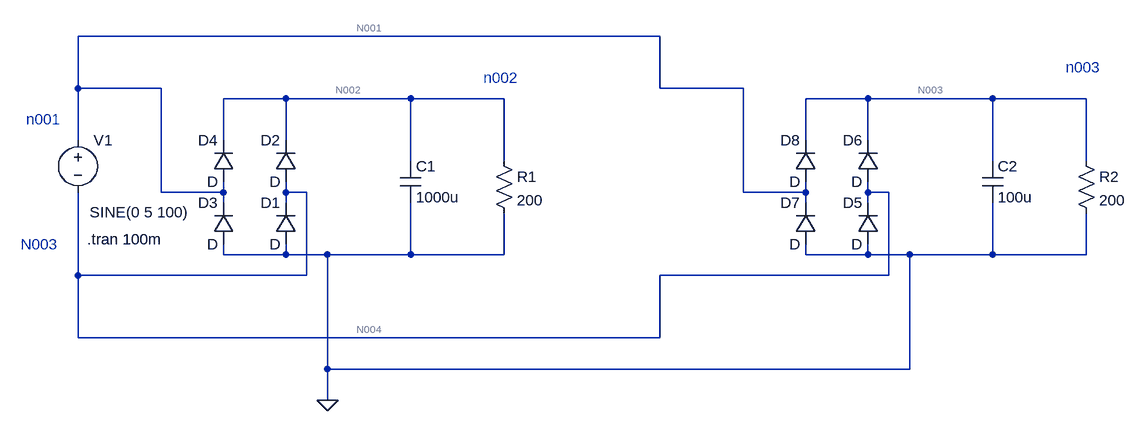
[diagram p0: schematic Yoneda-p88__Full-rectifier__with-2C_1000-100.asc]
Yoneda-p88__Full-rectifier__with-2C_1000-100.asc, the LTspice schematic file:
Version 4
SHEET 1 916 680
WIRE 192 -128 -704 -128
WIRE -704 -48 -704 -128
WIRE -576 -48 -704 -48
WIRE 192 -48 192 -128
WIRE 320 -48 192 -48
WIRE -384 -32 -480 -32
WIRE -192 -32 -384 -32
WIRE -48 -32 -192 -32
WIRE 512 -32 416 -32
WIRE 704 -32 512 -32
WIRE 848 -32 704 -32
WIRE -704 32 -704 -48
WIRE -480 32 -480 -32
WIRE -384 32 -384 -32
WIRE 416 32 416 -32
WIRE 512 32 512 -32
WIRE -192 64 -192 -32
WIRE -48 64 -48 -32
WIRE 704 64 704 -32
WIRE 848 64 848 -32
WIRE -576 112 -576 -48
WIRE -480 112 -480 96
WIRE -480 112 -576 112
WIRE -384 112 -384 96
WIRE -352 112 -384 112
WIRE 320 112 320 -48
WIRE 416 112 416 96
WIRE 416 112 320 112
WIRE 512 112 512 96
WIRE 544 112 512 112
WIRE -480 128 -480 112
WIRE -384 128 -384 112
WIRE 416 128 416 112
WIRE 512 128 512 112
WIRE -480 208 -480 192
WIRE -384 208 -384 192
WIRE -384 208 -480 208
WIRE -320 208 -384 208
WIRE -192 208 -192 128
WIRE -192 208 -320 208
WIRE -48 208 -48 144
WIRE -48 208 -192 208
WIRE 416 208 416 192
WIRE 512 208 512 192
WIRE 512 208 416 208
WIRE 576 208 512 208
WIRE 704 208 704 128
WIRE 704 208 576 208
WIRE 848 208 848 144
WIRE 848 208 704 208
WIRE -704 240 -704 112
WIRE -352 240 -352 112
WIRE -352 240 -704 240
WIRE 544 240 544 112
WIRE 544 240 192 240
WIRE -704 336 -704 240
WIRE 192 336 192 240
WIRE 192 336 -704 336
WIRE -320 384 -320 208
WIRE 576 384 576 208
WIRE 576 384 -320 384
WIRE -320 432 -320 384
FLAG -320 432 0
SYMBOL diode -368 192 R180
WINDOW 0 24 64 Left 2
WINDOW 3 24 0 Left 2
SYMATTR InstName D1
SYMBOL diode -368 96 R180
WINDOW 0 24 64 Left 2
WINDOW 3 24 0 Left 2
SYMATTR InstName D2
SYMBOL diode -464 192 R180
WINDOW 0 24 64 Left 2
WINDOW 3 24 0 Left 2
SYMATTR InstName D3
SYMBOL diode -464 96 R180
WINDOW 0 24 64 Left 2
WINDOW 3 24 0 Left 2
SYMATTR InstName D4
SYMBOL res -64 48 R0
SYMATTR InstName R1
SYMATTR Value 200
SYMBOL voltage -704 16 R0
WINDOW 3 18 127 Left 2
WINDOW 123 0 0 Left 2
WINDOW 39 0 0 Left 2
SYMATTR InstName V1
SYMATTR Value SINE(0 5 100)
SYMBOL cap -208 64 R0
SYMATTR InstName C1
SYMATTR Value 1000u
SYMBOL diode 528 192 R180
WINDOW 0 24 64 Left 2
WINDOW 3 24 0 Left 2
SYMATTR InstName D5
SYMBOL diode 528 96 R180
WINDOW 0 24 64 Left 2
WINDOW 3 24 0 Left 2
SYMATTR InstName D6
SYMBOL diode 432 192 R180
WINDOW 0 24 64 Left 2
WINDOW 3 24 0 Left 2
SYMATTR InstName D7
SYMBOL diode 432 96 R180
WINDOW 0 24 64 Left 2
WINDOW 3 24 0 Left 2
SYMATTR InstName D8
SYMBOL res 832 48 R0
SYMATTR InstName R2
SYMATTR Value 200
SYMBOL cap 688 64 R0
SYMATTR InstName C2
SYMATTR Value 100u
TEXT -690 184 Left 2 !.tran 100m
TEXT -784 0 Left 2 ;n001
TEXT -792 192 Left 2 ;N003
TEXT 816 -80 Left 2 ;n003
TEXT -80 -64 Left 2 ;n002

The netlist it stands for:
* Yoneda-p88__Full-rectifier__with-2C_1000-100.asc
D1 0 N004 D
D2 N004 N002 D
D3 0 N001 D
D4 N001 N002 D
R1 N002 0 200
V1 N001 N004 SINE(0 5 100)
C1 N002 0 1000u
D5 0 N004 D
D6 N004 N003 D
D7 0 N001 D
D8 N001 N003 D
R2 N003 0 200
C2 N003 0 100u
.model D D
.lib standard.dio
.tran 100m
* n001
* N003
* n003
* n002
.backanno
.end

* Results of the author's LTspice run, read from the files saved beside the schematic
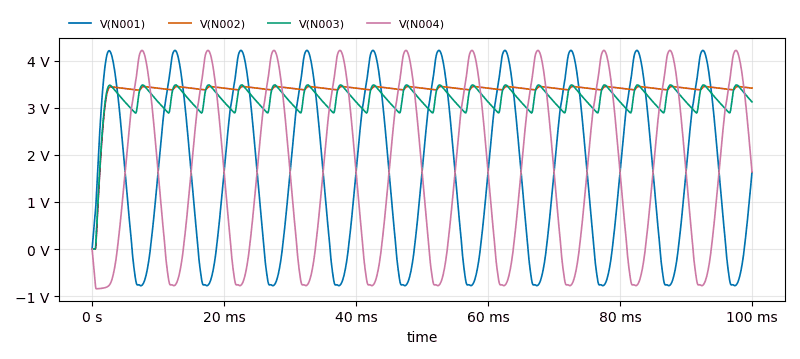
[diagram p1: Transient Analysis of Yoneda-p88__Full-rectifier__with-2C_1000-100.asc, plotted from the saved traces]
* Transient Analysis, 1 run:
*   V(N001): min -780.9 mV, max 4.222 V, average 1.616 V, rms 2.396 V, last 1.636 V
*   V(N002): min 0 V, max 3.455 V, average 3.377 V, rms 3.394 V, last 3.419 V
*   V(N003): min 0 V, max 3.488 V, average 3.17 V, rms 3.19 V, last 3.126 V
*   V(N004): min -845.7 mV, max 4.222 V, average 1.616 V, rms 2.41 V, last 1.636 V